# Altium schematic sheet sheet_buck.SchDoc
size A; SheetNumber: 1; SheetTotal: 1
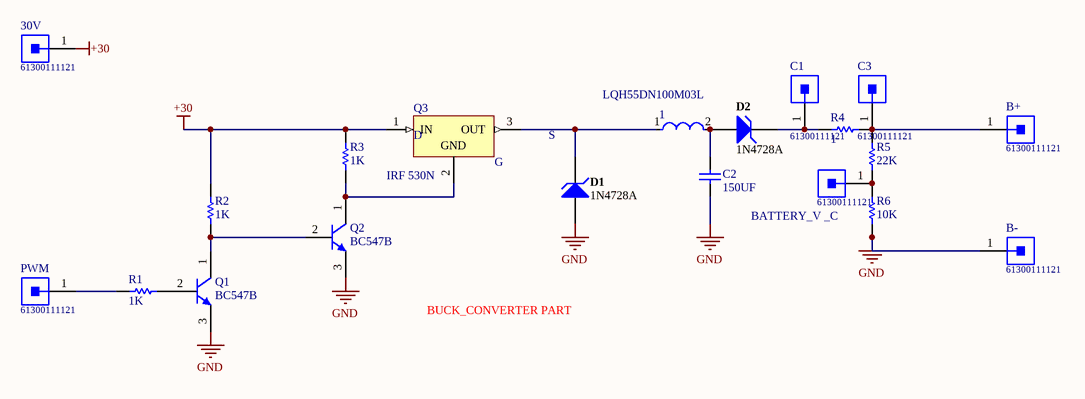
[diagram p0: sheet_buck.SchDoc]

## Parts
1  LQH55DN100M03L  [FP-LQH55DN_03-MFG]
30V  61300111121  [61300111121]
B+  61300111121  [61300111121]
B-  61300111121  [61300111121]
BATTERY_V__C  61300111121  [61300111121]
C1  61300111121  [61300111121]
C2  150UF  [KEMT-C315-THT-2]
C3  61300111121  [61300111121]
D1  1N4728A  [FAIR-DO-41-2_V]
D2  1N4728A  [FAIR-DO-41-2_V]
PWM  61300111121  [61300111121]
Q1  BC547B  [ONSC-TO-92-3-29-11]
Q2  BC547B  [ONSC-TO-92-3-29-11]
Q3  IRF 530N  [FAIR-TO-220-3]
R1  1K  [RESA60-630X240]
R2  1K  [RESA60-630X240]
R3  1K  [RESA60-630X240]
R4  1  [RESA60-630X240]
R5  22K  [RESA60-630X240]
R6  10K  [RESA60-630X240]

## Nets
+30: 30V.1 Q3.1(IN) R2.2 R3.2
GND: B-.1 C2.1 D1.1(A) Q1.3(E) Q2.3(E) R6.2
Net1_1: 1.1 D1.2(K) Q3.3(OUT)
Net1_2: 1.2 C2.2 D2.1(A)
NetB+_1: B+.1 C3.1 R4.1 R5.1
NetBATTERY_V__C_1: BATTERY_V__C.1 R5.2 R6.1
NetC1_1: C1.1 D2.2(K) R4.2
NetPWM_1: PWM.1 R1.2
NetQ1_1: Q1.1(C) Q2.2(B) R2.1
NetQ1_2: Q1.2(B) R1.1
NetQ2_1: Q2.1(C) Q3.2(GND) R3.1

## Notes on the sheet
- (near Q3) D
- (near Q3) G
- S
- BUCK_CONVERTER PART

## Library data of the parts
1 = CMP-2000-06586-2: FIXED IND 10UH 1.7A 93 MOHM SMD; Test Frequency: 1MHz; Series Resistance: 93mR; Inductance Tolerance: 20%; Self Resonant Frequency: 20MHz; Core Material: Ferrite; Shielding: Unshielded; Max DC Current: 1.7A; Height: 4.7mm; Military Standard: Not; Weight: 0.016932oz; Packaging: Tape and Reel; Max Operating Temperature: 80°C; Mount: Surface Mount; Case/Package: 2220; REACH SVHC: No SVHC; Case Code (Metric): 5750; Height - Seated (Max): 0.197inch; Case Code (Imperial): 2220; Depth: 5.3mm; Min Operating Temperature: -40°C; Length: 5.7mm; Width: 0.197inch; Package Quantity: 350; Radiation Hardening: No; DC Current: 1.7A; Tolerance: 20%; Termination: SMD/SMT; Lead Free: Lead Free; DC Resistance (DCR): 93mR; Inductance: 10uH; Current Rating: 1.7A; Resistor Type: Wirewound
30V B+ B- BATTERY_V__C C1 C3 PWM = CMP-1502-01058-1: THT Vertical Pin Header WR-PHD, Pitch 2.54 mm, Single Row, 1 pins; Manufacturer: Wurth Elektronik; Gender: Male; Working Voltage: 250VAC; Withstanding Voltage: 500VAC; Pin Number: 1; Contact Resistance: 20mOhm; Rated Current: 3A; Pitch: 2.54mm; Mounting Technology: THT; Datasheet URL: https://katalog.we-online.de/em/datasheet/6130xx11121.pdf; Manufacturer URL: http://www.we-online.de; Operating Temperature: -40to105degC; Publisher: WurthElektronik; Part Number: 61300111121; Row Number: Single; Package Reference: 61300111121; Orientation: Vertical; Packaging: Bag
C2 = CMP-1664-00007-1: Capacitor, Ceramic, 0.01 uF, +/- 10%, 100 V, X7R, -55 to 125 degC, 2-Pin THD, RoHS, Bulk; Output Voltage: 70 V; Case\Package: PDIP; Forward Current: 60 mA; Nominal Vf: 1.3 V; Forward Voltage: 1.5 V; Channels: 2; Max Power Dissipation: 400 mW; Vce Max: 500 mV; ComponentLink1Description: Manufacturer URL; ComponentLink2Description: Datasheet; Packaging: Rail/Tube; RoHSCompliant: true; Package Quantity: 2000; PackageReference: C315-THT-2; Min Operating Temperature: -55 degC; Max Operating Temperature: 100 degC; Radiation Hardening: No; ComponentLink1URL: http://www.kemet.com/; DatasheetVersion: Aug-16; Pins: 16; PackageDescription: 2-Pin Through Hole Device, Body 3.81 x 2.54 mm; REACH SVHC: Unknown; Mount: Through Hole; ComponentLink2URL: http://capacitoredge.kemet.com/capedge2/DataSheet/Datasheet-C315C103K1R5TA.pdf?pn=C315C103K1R5TA{BULK}
D1 D2 = CMP-0892-00028-1: Zener Diode, 3.3V, 1W, 5%, -65 to 200 degC, 2-Pin DO-41, Body 2.72 x 5.2 mm, RoHS; Manufacturer: Fairchild Semiconductor; PD (W): 1; VZ (Max.) (V): 3.465; IR (uA): 100; ZZ (Max) (ohm): 10; Test Current IZ (mA): 76; VZ (Min.) (V): 3.135; DatasheetVersion: Rev. H3; Tolerance: 5%; ComponentLink3URL: http://www.fairchildsemi.com/dwg/DO/DO41A.pdf; ComponentLink2Description: Datasheet; PackageDescription: 2-Pin Axial leaded, Body 2.72 x 5.2 mm, Lead Spread 25.4 mm; PartNumber: 1N4728A; Operating and Storage Temperature Range: -65 to 200 degC; Mounting Technology: Through Hole; ComponentLink3Description: Package Specification; PackageReference: DO-41-2; ComponentLink1URL: http://www.fairchildsemi.com/; RoHS: TRUE; ComponentLink1Description: Manufacturer URL; ComponentLink2URL: http://www.fairchildsemi.com/ds/1N/1N4744A.pdf; PackageVersion: Rev. 2
Q1 Q2 = CMP-1048-01467-1: Amplifier Transistor, NPN Silicon, 3-Pin TO-92, Bulk Box; Manufacturer: On Semiconductor; IC Continuous (A): 0.1; fT Min (MHz): 150; DatasheetVersion: Rev. 7; ComponentLink1URL: http://www.onsemi.com/; Polarity: NPN; RoHS: FALSE; ComponentLink1Description: Manufacturer URL; Packing: Bulk Box; PackageDescription: 3-Pin Transistor Outline, Body 4.825 x 3.685 mm, Pitch 1.27 mm; ComponentLink3URL: http://www.onsemi.cn/pub_link/Collateral/2N6426-D.PDF; ComponentLink2Description: Datasheet; PackageVersion: Rev. AM; PackageReference: TO-92-3-29-11_AM_SL; ComponentLink3Description: Package Specification; Mounting Technology: Through Hole; PartNumber: BC547B; ComponentLink2URL: http://www.onsemi.com/pub_link/Collateral/BC546-D.PDF
Q3 = CMP-2000-04938-1: Positive Voltage Regulator, 5 V, 1 A, -40 to 125 degC, 3-Pin TO-220, RoHS, Tube; Manufacturer: FairchildSemiconductor; Maximum Input Voltage: 35V; Maximum Quiescent Current: 8mA; Load Regulation: 100mV; Maximum Output Current: 2.2(Typ)A; Output Type: Fixed; Typical Dropout Voltage @ Current: 2@1AV; Rad Hard: No; Output Voltage: 5V; Accuracy: ±4%; Type: Linear; Number of Outputs: 1; Category: LinearRegulator; Package Description: 3-Pin Through Hole Device, Body 10 x 4.5 mm, Pitch 2.54 mm; Packaging: Rail/Tube; Mounting: ThroughHole; Polarity: Positive; Manufacturer URL: https://www.fairchildsemi.com/; Line Regulation: 100mV; Datasheet Version: Aug-12; Datasheet URL: https://datasheet.ciiva.com/26904/lm7805ct-26904988.pdf; Package Reference: TO-220; Package URL: https://www.fairchildsemi.com/package-drawings/TO/TO220B03.pdf; Package: 3TO-220AB; Operating Temperature: -40to125degC
R1-R6 = CMP-1659-00075-1: Axial Resistor, 1 KOhm, +/- 1%, 250 mW, -55 to 155 degC, 2-Pin THD, RoHS, Bulk; Voltage Rating: 250 V; Resistance: 10 kohm; Power Rating: 250 mW; ComponentLink2Description: Datasheet; RoHSCompliant: true; PackageReference: MFR-25; Case\Package: Axial; Max Operating Temperature: 155 degC; DatasheetVersion: Apr-13; Tolerance: 1%; ComponentLink1URL: http://www.yageo.com/; Length: 0.248 inch; ComponentLink2URL: http://www.yageo.com/documents/recent/Yageo%20LR_MFR_2013.pdf; Packaging: Bulk; Package Quantity: 200; PackageDescription: 2-Pin Axial Lead, Dia 2.4 mm, Body Length 6.3 mm; Min Operating Temperature: -55 degC; ComponentLink1Description: Manufacturer URL